# Altium schematic sheet Charger.SchDoc
size A4; SheetNumber: 1; SheetTotal: 1
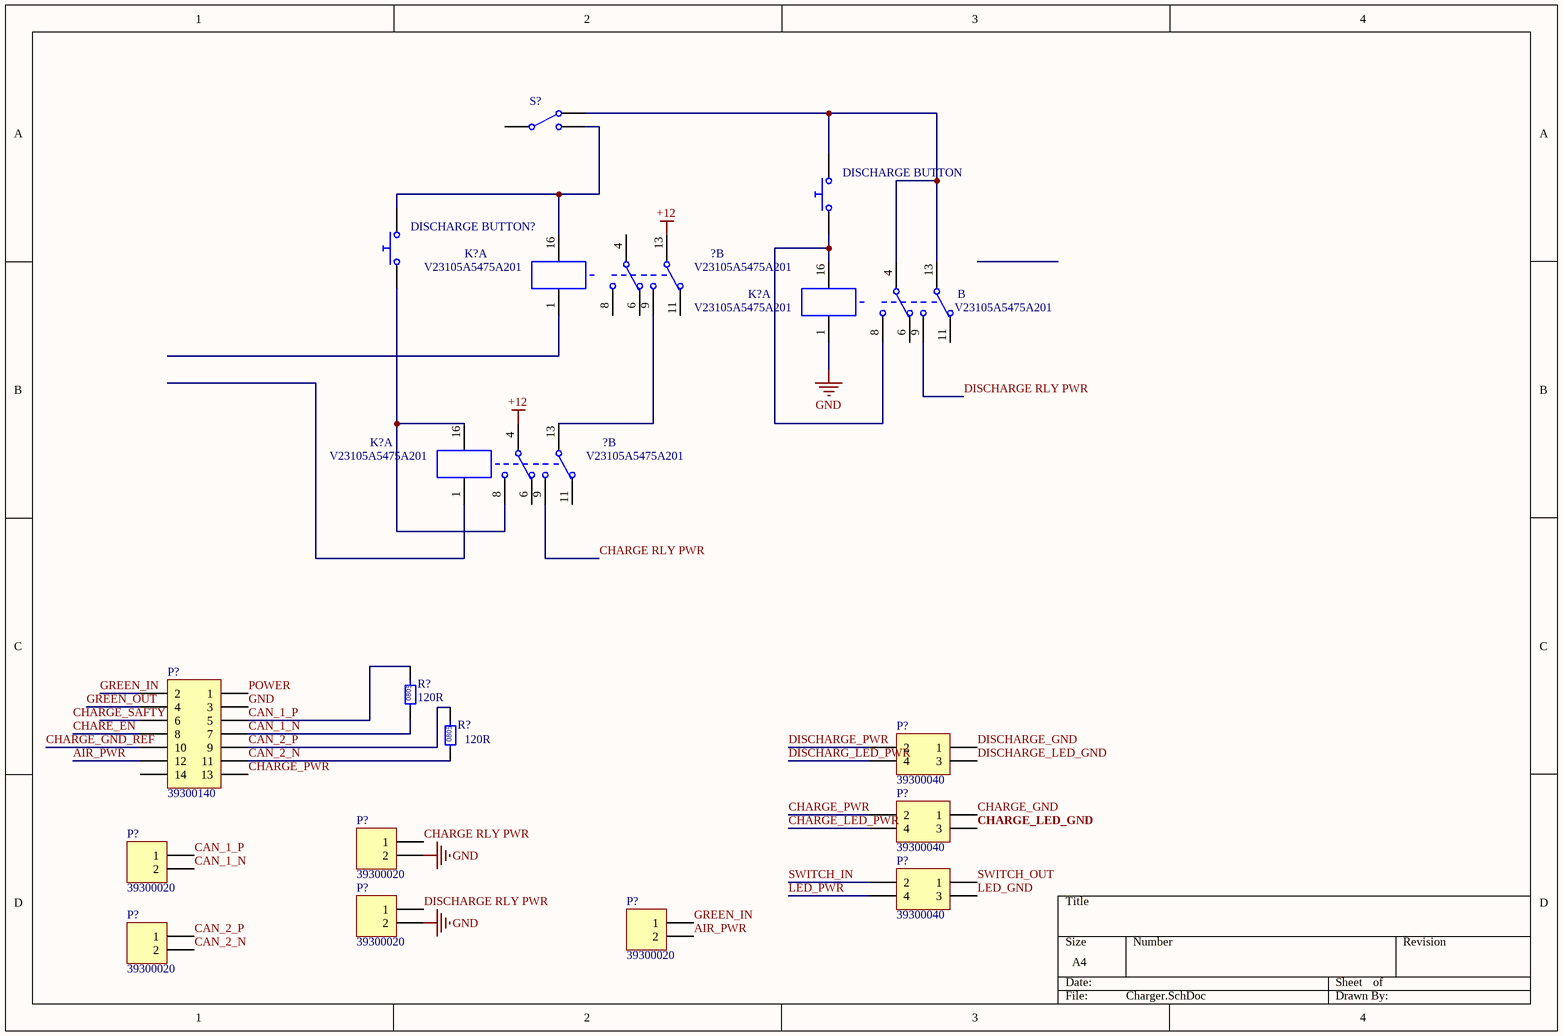
[diagram p0: Charger.SchDoc]

## Parts
(Parts that share a designator on the sheet are numbered #1, #2 ... from top to bottom, then left to right.)
?#1  V23105A5475A201  [TI 2-DIL]  (part B of 2)
?#2  V23105A5475A201  [TI 2-DIL]  (part B of 2)
DISCHARGE_BUTTON  Push Button Normally Opened  (value not drawn)
DISCHARGE_BUTTON?  Push Button Normally Opened  (value not drawn)
K?#1  V23105A5475A201  [TI 2-DIL]  (part A of 2)
K?#2  V23105A5475A201  [TI 2-DIL]  (part A of 2)
K?#3  V23105A5475A201  [TI 2-DIL]  (part A of 2)
P?#1  39300140  [39300140]
P?#2  39300040  [39300040]
P?#3  39300040  [39300040]
P?#4  39300020  [39300020]
P?#5  39300020  [39300020]
P?#6  39300040  [39300040]
P?#7  39300020  [39300020]
P?#8  39300020  [39300020]
P?#9  39300020  [39300020]
R?#1  120R  [0805]
R?#2  120R  [0805]
S?  Single-Pole, Double-Throw Switch  (value not drawn)
  V23105A5475A201  [TI 2-DIL]  (part B of 2)

## Nets
+12: ?#1.13 ?#2.4
GND: K?#2.1 P?#1.3 P?#4.2 P?#7.2
AIR_PWR: P?#1.12 P?#8.2
CAN_1_N: P?#1.7 P?#5.2 R?#1.1
CAN_1_P: P?#1.5 P?#5.1 R?#1.2
CAN_2_N: P?#1.11 P?#9.2 R?#2.1
CAN_2_P: P?#1.9 P?#9.1 R?#2.2
CHARE_EN: P?#1.8
CHARGE RLY PWR: ?#2.9 P?#4.1
CHARGE_GND: P?#3.1
CHARGE_GND_REF: P?#1.10
CHARGE_LED_GND: P?#3.3
CHARGE_LED_PWR: P?#3.4
CHARGE_PWR: P?#1.13 P?#3.2
DISCHARG_LED_PWR: P?#2.4
DISCHARGE RLY PWR: P?#7.1 .9
DISCHARGE_GND: P?#2.1
DISCHARGE_LED_GND: P?#2.3
DISCHARGE_PWR: P?#2.2
GREEN_IN: P?#1.2 P?#8.1
GREEN_OUT: P?#1.4
LED_GND: P?#6.3
LED_PWR: P?#6.4
POWER: P?#1.1
SWITCH_IN: P?#6.2
SWITCH_OUT: P?#6.1
Net?#1_9: ?#1.9 ?#2.13
Net?#2_8: ?#2.8 DISCHARGE_BUTTON?.1 K?#3.16
NetDISCHARGE_BUTTON?_2: DISCHARGE_BUTTON?.2 K?#1.16 S?.2
NetDISCHARGE_BUTTON_1: DISCHARGE_BUTTON.1 K?#2.16 .8
NetDISCHARGE_BUTTON_2: DISCHARGE_BUTTON.2 S?.3 .4 .13

Not connected (* = marked no-connect by the designer): ?#1 4 6 8 11; ?#2 6 11; K?#1 1; K?#3 1; P?#1 6 14; S? 1;  6 11

## Notes on the sheet
- Labels drawn without touching a wire or pin: CHARGE_SAFTY
- (in symbol RC0805FR07120RL) 0805

## Library data of the parts
?#1 ?#2 K?#1-K?#3  = V23105A5475A201: 5V DPDT Relay 3A 220VDC; Manufacturer: Axicom; Part Number: V23105A5475A201; Digikey Part Number: PB383-ND; Digikey Link: https://www.digikey.com/products/en?mpart=V23105A5001A201&v=41
DISCHARGE_BUTTON DISCHARGE_BUTTON? = Push Button NO: closed: 0; Rclosed: 1m; Ropen: 1Meg; SimulationGenericComponent: True
P?#1 = 39300140: Pitch: 4.2mm; Row Spacing: 5.5mm; Angle: 90; Flange: No; Contact: Tin; Part Number: 39300140; Positions: 14; Digikey Part Number: WM21357-ND
P?#2 P?#3 P?#6 = 39300040: Pitch: 4.2mm; Row Spacing: 5.5mm; Angle: 90; Flange: No; Contact: Tin; Part Number: 39300040; Positions: 4; Digikey Part Number: WM21352-ND
P?#4 P?#5 P?#7-P?#9 = 39300020: Pitch: 4.2mm; Row Spacing: 5.5mm; Angle: 90; Flange: No; Contact: Tin; Part Number: 39300020; Positions: 2; Digikey Part Number: WM21351-ND
R?#1 R?#2 = RC0805FR07120RL: Manufacturer: YAGEO; Tolerance: 0.01; Rated Power: 0.125W; Part Number: RC0805FR07120RL; Value: 120R; Material: FR-07; Digikey Part Number: 311-120CRCT-ND
S? = SPDT SW: nodeUP_closed: 1; Rclosed: 1m; Ropen: 1Meg; SimulationGenericComponent: True